# EAGLE design weather_station1 (EAGLE 7.6.0)
Weather Station
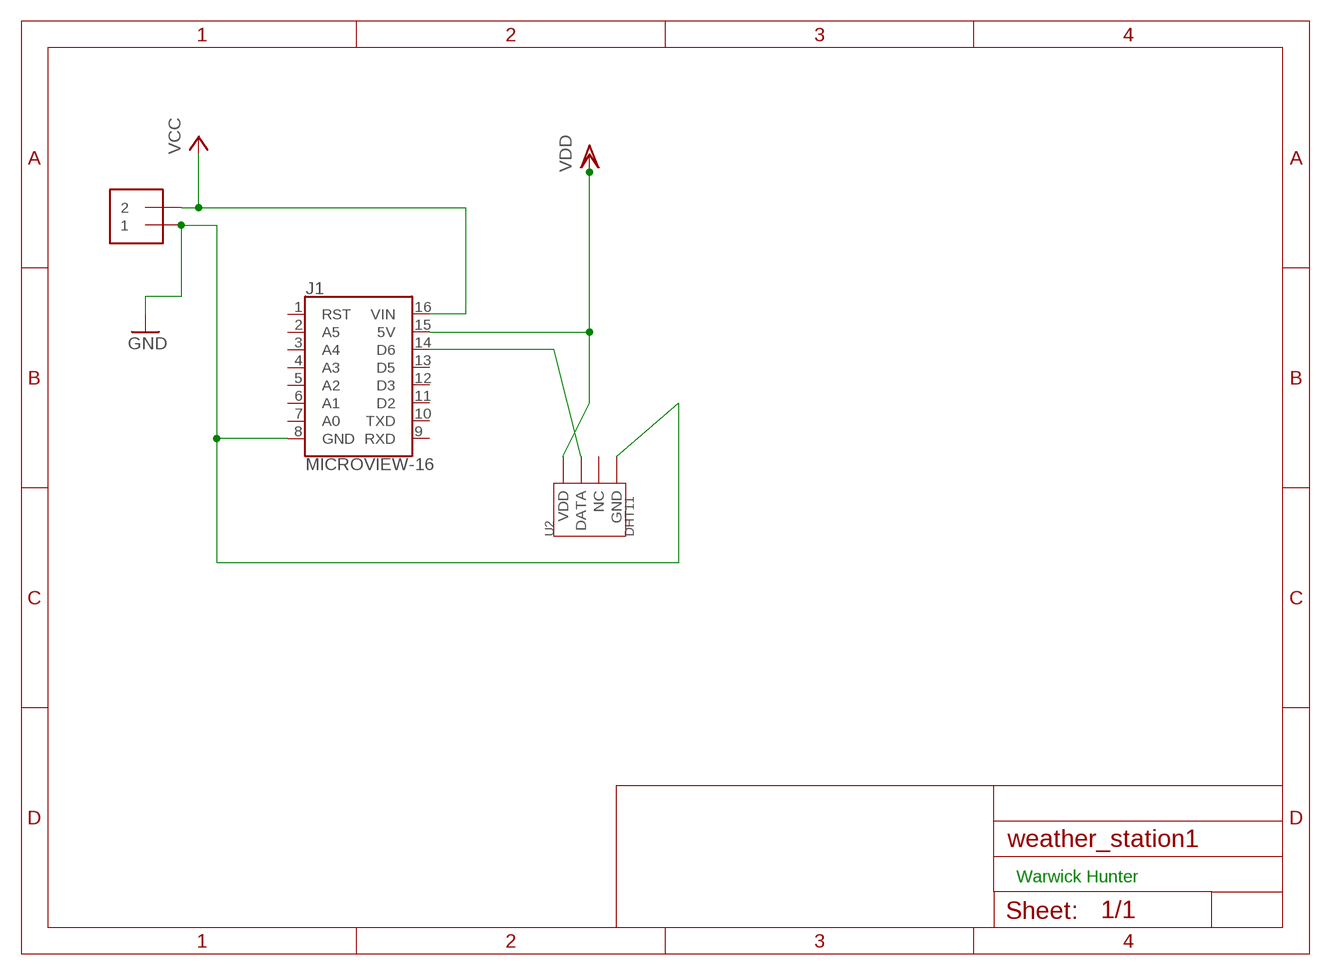
[diagram p0: schematic, sheet 1]

## Parts
J1  MICROVIEW-16  [MV-DIP16]
J2  1X2-3.5MM  [1X2-3.5MM]
U2  DHT11  TEM-HUM-DHT11(4P-15.5X12.0MM)  [SNR4-2.54-15.5X12.0X5.5MM]

## Nets
GND: J1.8(GND) J2.1 U2.4(GND)
N$2: J1.14(D6) U2.2(DATA)
VCC: J1.16(VIN) J2.2
VDD: J1.15(5V) U2.1(VDD)
Unconnected: J1.1(RST) J1.2(A5) J1.3(A4) J1.4(A3) J1.5(A2) J1.6(A1) J1.7(A0) J1.9(RXD) J1.10(TXD) J1.11(D2) J1.12(D3) J1.13(D5) U2.3(NC)

## Notes on the sheet
- Warwick Hunter

## Library data of the parts
J1 = microView-temp:MICROVIEW-16
J2 = adafruit:1X2: 3.5mm Terminal block http://www.ladyada.net/library/pcb/eaglelibrary.html
U2 = Seeed-OPL-sensor:TEM-HUM-DHT11(4P-15.5X12.0MM): 314010000; MPN: DHT11

## Board
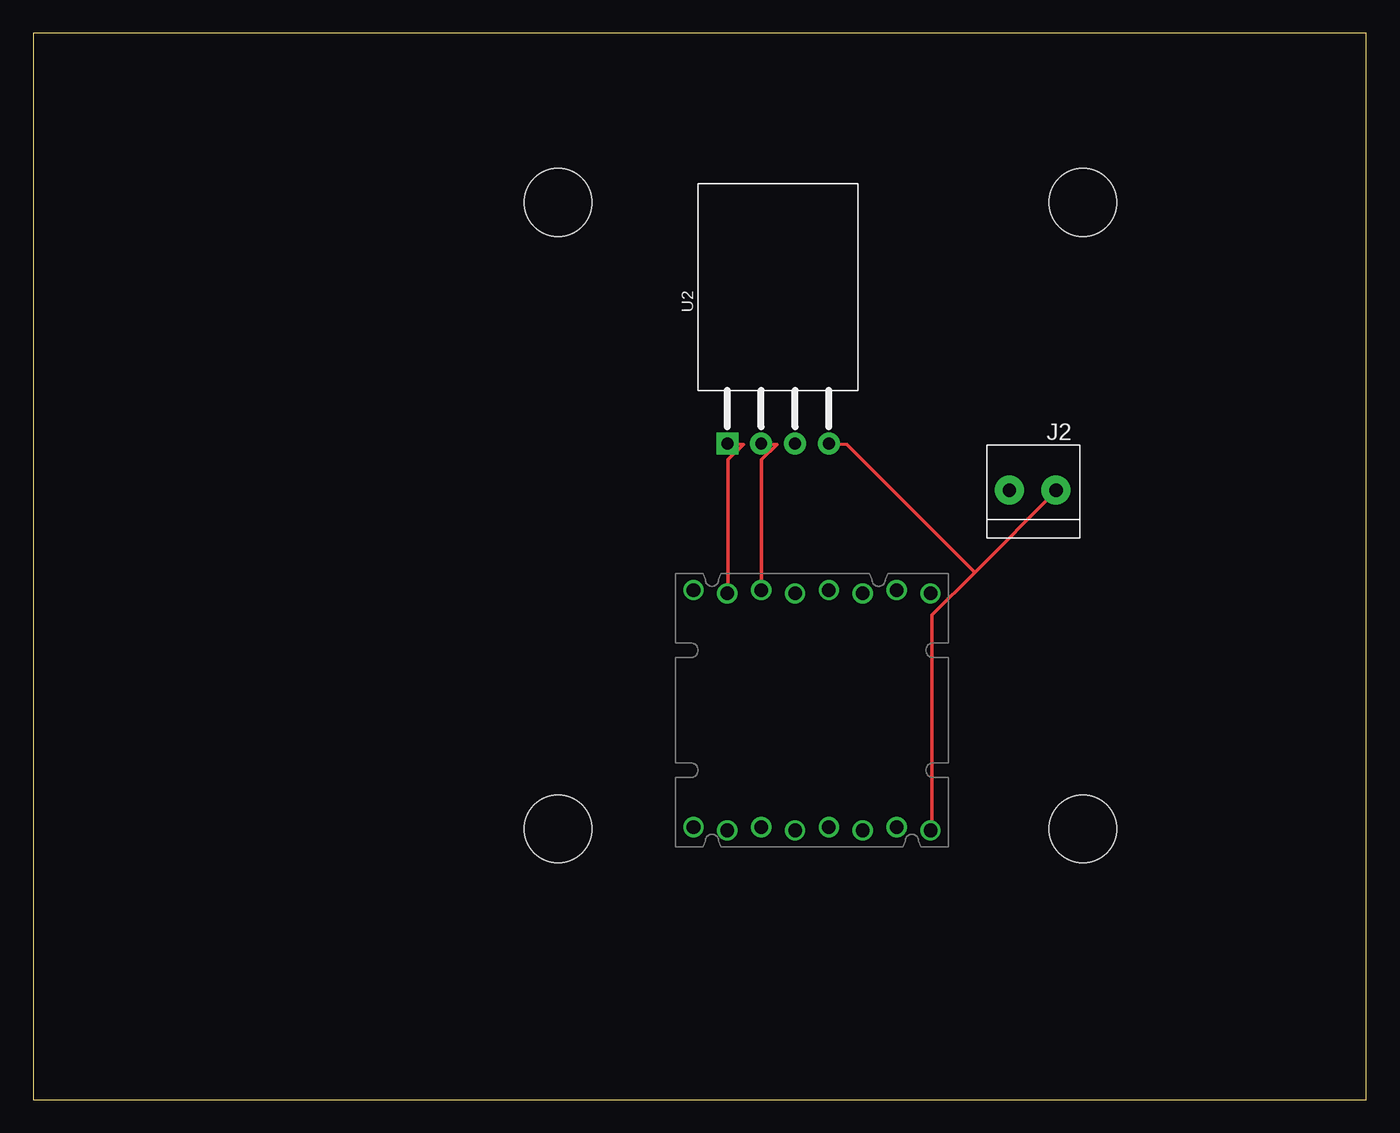
[diagram p1: board, top side]
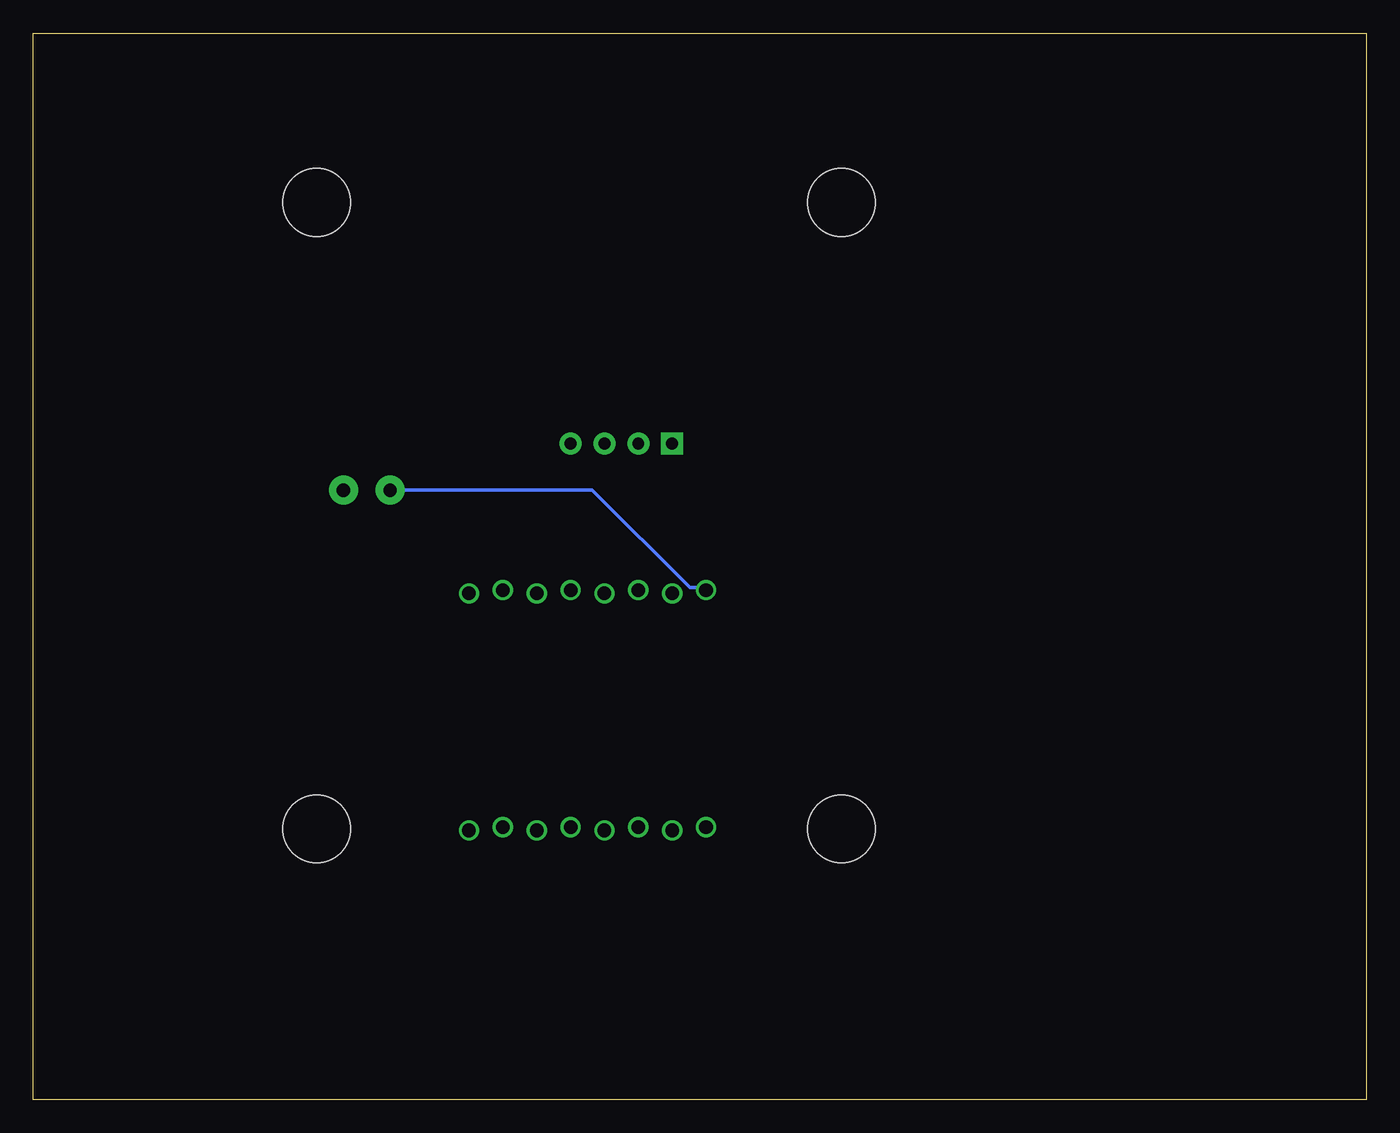
[diagram p2: board, bottom side, seen from below]

Size 100 x 80 mm. Coordinates in mm from the lower left corner, seen from the top.
Outline: 0,0 100,0 100,80 0,80 0,0
Copper layers (1*16): Top 0.035mm / dielectric 1.5mm / Bottom 0.035mm
Design rules "default": minimum track width 10mil, minimum drill 24mil, track to track 8mil, track to pad 8mil, pad to pad 8mil, via to via 8mil, smd to smd 8mil, copper to edge 40mil, drill to drill 8mil, minimum pad ring 10mil, minimum via ring 8mil, stop-mask expansion 4mil, vias tented up to drill 0mil, thermal gap 10mil
Holes 5.08 mm at 39.37,67.31 78.74,67.31 78.74,20.32 39.37,20.32

### Footprints (pad centres in the part's own frame; a part is rotated, then mirrored left to right if it is on the bottom)
MV-DIP16 = drill 1.016: 1 -8.89,-8.763; 2 -6.35,-9.017; 3 -3.81,-8.763; 4 -1.27,-9.017; 5 1.27,-8.763; 6 3.81,-9.017; 7 6.35,-8.763; 8 8.89,-9.017; 9 8.89,8.763; 10 6.35,9.017; 11 3.81,8.763; 12 1.27,9.017; 13 -1.27,8.763; 14 -3.81,9.017; 15 -6.35,8.763; 16 -8.89,9.017
1X2-3.5MM = drill 1 pad 2.184: 1 1.8,0; 2 -1.7,0
SNR4-2.54-15.5X12.0X5.5MM = drill 0.889 pad 1.651 square: 1 -11.75,3.81 | drill 0.889 pad 1.651: 2 -11.75,1.27; 3 -11.75,-1.27; 4 -11.75,-3.81

### Placement (x,y rotation side)
J1  58.42,29.21 0 top
J2  74.93,45.72 0 top
U2  55.88,60.96 90 top

### Tracks (layer width: path | path; a pad name or v marks a point on that pad's centre or on a via)
GND
  Top 0.254: 70.64,39.55 76.81,45.72 J2.1 | 70.64,39.55 67.44,36.35 67.44,20.34 J1.8 | 70.64,39.55 61.04,49.15 U2.4
N$2
  Top 0.254: J1.14 54.63,38.41 54.63,48.01 55.78,49.15 U2.2
VCC
  Bottom 0.254: J2.2 58.06,45.72 50.75,38.41 49.61,38.41 J1.16
VDD
  Top 0.254: J1.15 52.12,38.18 52.12,48.01 53.26,49.15 U2.1